# Altium schematic sheet PlataMagnitometra.SchDoc
size 594 x 420 mm; ApprovedBy: Шилкин; CheckedBy: Шилкин; Author: Шилкин; SheetNumber: 1; SheetTotal: 2
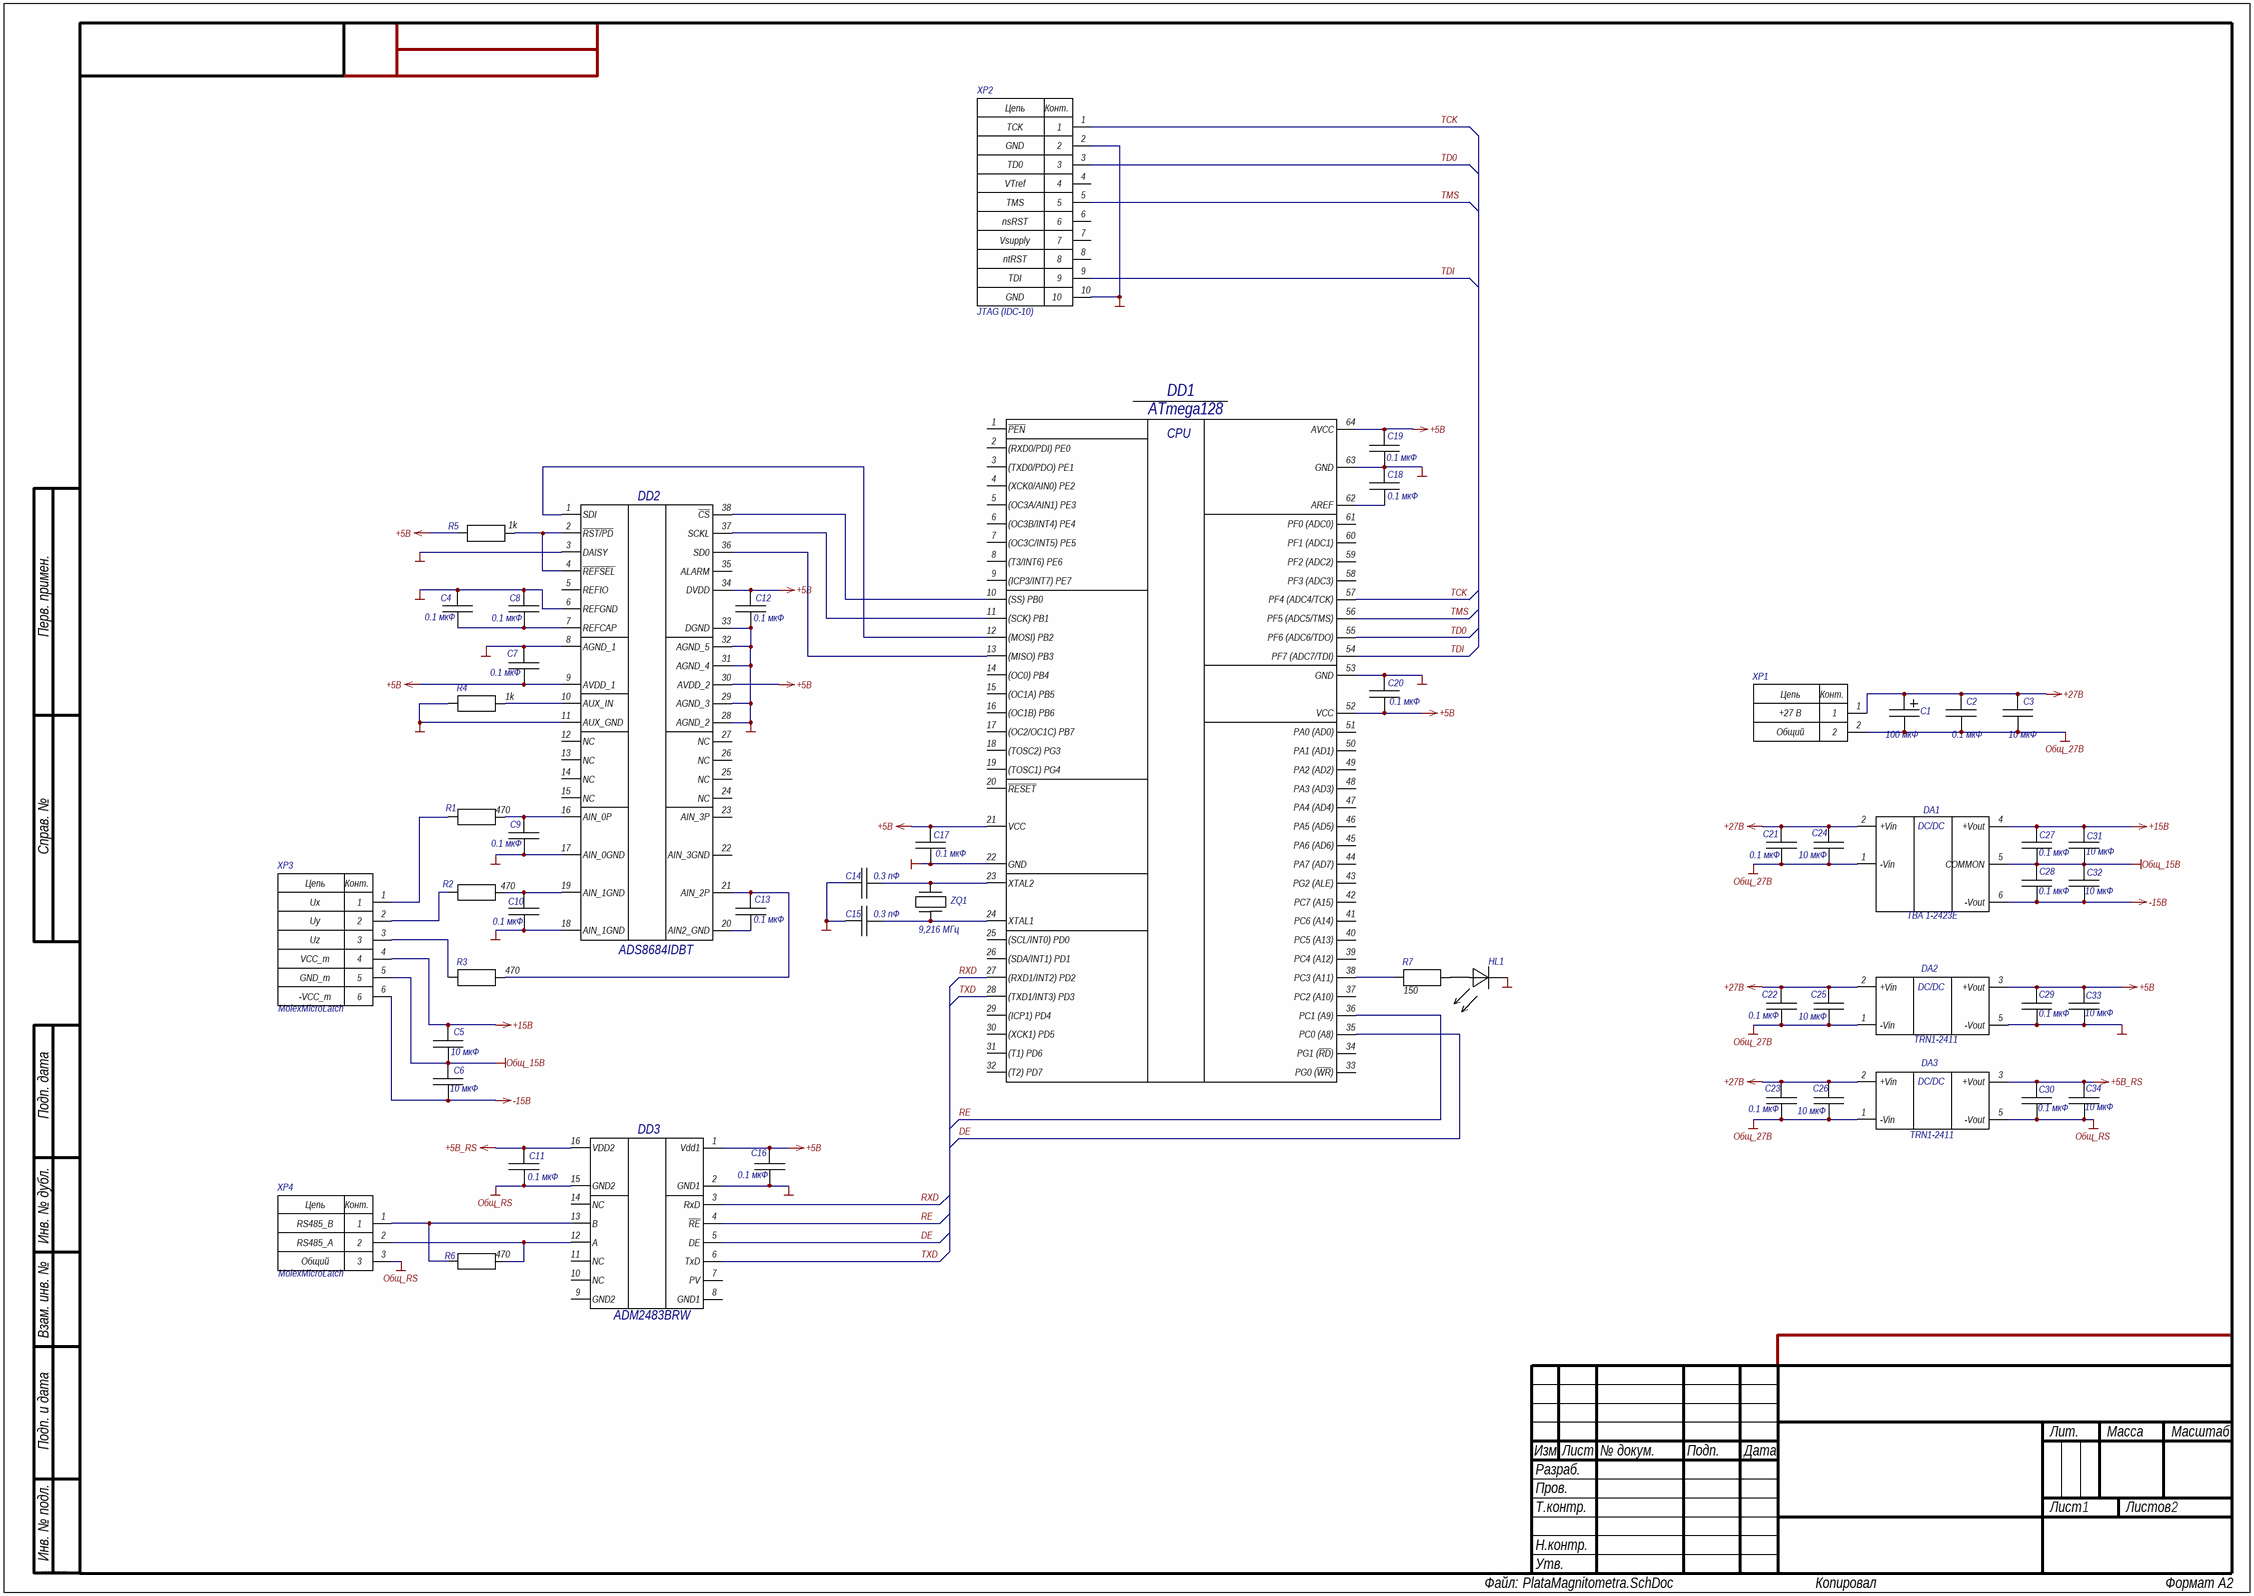
[diagram p0: PlataMagnitometra.SchDoc]

## Parts
C1  value 100 мкФ  [TANT CAP D]  (hidden comment: Конденсатор электрол. 10 В 100 мкФ Ом, ±10%, TANT CAP D)
C2  value 0.1 мкФ  [CAP0805]  (hidden comment: Конденсатор керамич. 50 В 0.1 мкФ Ом, ±10%, X7R SMD 0805)
C3  value 10 мкФ  [CAP0805]  (hidden comment: Конденсатор керамич. 50 В 10 мкФ Ом, ±10%, X5R SMD 0805)
C4  value 0.1 мкФ  [CAP0805]  (hidden comment: Конденсатор керамич. 50 В 0.1 мкФ Ом, ±10%, X7R SMD 0805)
C5  value 10 мкФ  [CAP0805]  (hidden comment: Конденсатор керамич. 50 В 10 мкФ Ом, ±10%, X5R SMD 0805)
C6  value 10 мкФ  [CAP0805]  (hidden comment: Конденсатор керамич. 50 В 10 мкФ Ом, ±10%, X5R SMD 0805)
C7  value 0.1 мкФ  [CAP0805]  (hidden comment: Конденсатор керамич. 50 В 0.1 мкФ Ом, ±10%, X7R SMD 0805)
C8  value 0.1 мкФ  [CAP0805]  (hidden comment: Конденсатор керамич. 50 В 0.1 мкФ Ом, ±10%, X7R SMD 0805)
C9  value 0.1 мкФ  [CAP0805]  (hidden comment: Конденсатор керамич. 50 В 0.1 мкФ Ом, ±10%, X7R SMD 0805)
C10  value 0.1 мкФ  [CAP0805]  (hidden comment: Конденсатор керамич. 50 В 0.1 мкФ Ом, ±10%, X7R SMD 0805)
C11  value 0.1 мкФ  [CAP0805]  (hidden comment: Конденсатор керамич. 50 В 0.1 мкФ Ом, ±10%, X7R SMD 0805)
C12  value 0.1 мкФ  [CAP0805]  (hidden comment: Конденсатор керамич. 50 В 0.1 мкФ Ом, ±10%, X7R SMD 0805)
C13  value 0.1 мкФ  [CAP0805]  (hidden comment: Конденсатор керамич. 50 В 0.1 мкФ Ом, ±10%, X7R SMD 0805)
C14  value 0.3 пФ  [CAP0805]  (hidden comment: Конденсатор керамич. 50 В 0.3 пФ Ом, +0.25pF, X5R SMD 0805)
C15  value 0.3 пФ  [CAP0805]  (hidden comment: Конденсатор керамич. 50 В 0.3 пФ Ом, +0.25pF, X5R SMD 0805)
C16  value 0.1 мкФ  [CAP0805]  (hidden comment: Конденсатор керамич. 50 В 0.1 мкФ Ом, ±10%, X7R SMD 0805)
C17  value 0.1 мкФ  [CAP0805]  (hidden comment: Конденсатор керамич. 50 В 0.1 мкФ Ом, ±10%, X7R SMD 0805)
C18  value 0.1 мкФ  [CAP0805]  (hidden comment: Конденсатор керамич. 50 В 0.1 мкФ Ом, ±10%, X7R SMD 0805)
C19  value 0.1 мкФ  [CAP0805]  (hidden comment: Конденсатор керамич. 50 В 0.1 мкФ Ом, ±10%, X7R SMD 0805)
C20  value 0.1 мкФ  [CAP0805]  (hidden comment: Конденсатор керамич. 50 В 0.1 мкФ Ом, ±10%, X7R SMD 0805)
C21  value 0.1 мкФ  [CAP0805]  (hidden comment: Конденсатор керамич. 50 В 0.1 мкФ Ом, ±10%, X7R SMD 0805)
C22  value 0.1 мкФ  [CAP0805]  (hidden comment: Конденсатор керамич. 50 В 0.1 мкФ Ом, ±10%, X7R SMD 0805)
C23  value 0.1 мкФ  [CAP0805]  (hidden comment: Конденсатор керамич. 50 В 0.1 мкФ Ом, ±10%, X7R SMD 0805)
C24  value 10 мкФ  [CAP0805]  (hidden comment: Конденсатор керамич. 50 В 10 мкФ Ом, ±10%, X5R SMD 0805)
C25  value 10 мкФ  [CAP0805]  (hidden comment: Конденсатор керамич. 50 В 10 мкФ Ом, ±10%, X5R SMD 0805)
C26  value 10 мкФ  [CAP0805]  (hidden comment: Конденсатор керамич. 50 В 10 мкФ Ом, ±10%, X5R SMD 0805)
C27  value 0.1 мкФ  [CAP0805]  (hidden comment: Конденсатор керамич. 50 В 0.1 мкФ Ом, ±10%, X7R SMD 0805)
C28  value 0.1 мкФ  [CAP0805]  (hidden comment: Конденсатор керамич. 50 В 0.1 мкФ Ом, ±10%, X7R SMD 0805)
C29  value 0.1 мкФ  [CAP0805]  (hidden comment: Конденсатор керамич. 50 В 0.1 мкФ Ом, ±10%, X7R SMD 0805)
C30  value 0.1 мкФ  [CAP0805]  (hidden comment: Конденсатор керамич. 50 В 0.1 мкФ Ом, ±10%, X7R SMD 0805)
C31  value 10 мкФ  [CAP0805]  (hidden comment: Конденсатор керамич. 50 В 10 мкФ Ом, ±10%, X5R SMD 0805)
C32  value 10 мкФ  [CAP0805]  (hidden comment: Конденсатор керамич. 50 В 10 мкФ Ом, ±10%, X5R SMD 0805)
C33  value 10 мкФ  [CAP0805]  (hidden comment: Конденсатор керамич. 50 В 10 мкФ Ом, ±10%, X5R SMD 0805)
C34  value 10 мкФ  [CAP0805]  (hidden comment: Конденсатор керамич. 50 В 10 мкФ Ом, ±10%, X5R SMD 0805)
DA1  Model: TBA 1-2423E  [TBA12411E]  (hidden comment: DC/DC, 15Вт, Uвх: 18-36В, Uвых: 15ВDC, Iвых: 500мА)
DA2  Model: TRN1-2411  [TRN1]  (hidden comment: DC/DC 1Вт, Uвх 18-36В, 5ВDC, Iвых 200мА)
DA3  Model: TRN1-2411  [TRN1]  (hidden comment: DC/DC 1Вт, Uвх 18-36В, 5ВDC, Iвых 200мА)
DD1  ATmega128  [TQFP64]
DD2  ADS8684IDBT  [38TSSOP]
DD3  ADM2483BRW  [SOIC-16 WIDE]
HL1  Светодиод SMD KP-2012  [LED0805 Red]  (value not drawn)
R1  value 470  [RES0805]  (hidden comment: Чип резистор 0.125Вт 470 Ом, 5%,  SMD SMD 0805)
R2  value 470  [RES0805]  (hidden comment: Чип резистор 0.125Вт 470 Ом, 5%,  SMD SMD 0805)
R3  value 470  [RES0805]  (hidden comment: Чип резистор 0.125Вт 470 Ом, 5%,  SMD SMD 0805)
R4  value 1k  [RES0805]  (hidden comment: Чип резистор 0.125Вт 1k Ом, 5%,  SMD SMD 0805)
R5  value 1k  [RES0805]  (hidden comment: Чип резистор 0.125Вт 1k Ом, 5%,  SMD SMD 0805)
R6  value 470  [RES0805]  (hidden comment: Чип резистор 0.125Вт 470 Ом, 5%,  SMD SMD 0805)
R7  value 150  [RES0805]  (hidden comment: Чип резистор 0.125Вт 150 Ом, 5%,  SMD SMD 0805)
XP1  Коннектор JST Corporation, 2 мм, 1 ряд, 2 контактa  [2pinMicroLatch]  (value not drawn)
XP2  JTAG (IDC-10)  [IDC10]
XP3  value MolexMicroLatch  [6pinMicroLatch]  (hidden comment: Коннектор Micro-Latch, Signal, 2 мм, 1 ряд, 6 контактов)
XP4  value MolexMicroLatch  [3pinMicroLatch]  (hidden comment: Коннектор Micro-Latch, Signal, 2 мм, 1 ряд, 3 контактa)
ZQ1  value 9,216 МГц  [HC49S4HSMD]  (hidden comment: Резонатор кварцевый низкопрофильный 9.216 МГц SMT)

## Nets
+5В: C7.1 C12.2 C16.1 C17.2 C19.1 C20.2 C29.1 C33.1 DA2.3(+Vout) DD1.21(VCC) DD1.52(VCC) DD1.64(AVCC) DD2.9(AVDD_1) DD2.30(AVDD_2) DD2.34(DVDD) DD3.1(Vdd1) R5.2
+5В_RS: C11.2 C30.1 C34.1 DA3.3(+Vout) DD3.16(VDD2)
+15В: C5.1 C27.1 C31.1 DA1.4(+Vout) XP3.4
+27В: C1.2 C2.1 C3.1 C21.1 C22.1 C23.1 C24.1 C25.1 C26.1 DA1.2(+Vin) DA2.2(+Vin) DA3.2(+Vin) XP1.1
-15В: C6.2 C28.2 C32.2 DA1.6(-Vout) XP3.6
Общ_5В: C4.2 C7.2 C8.2 C9.1 C10.1 C12.1 C14.2 C15.2 C16.2 C17.1 C18.1 C19.2 C20.1 C29.2 C33.2 DA2.5(-Vout) DD1.22(GND) DD1.53(GND) DD1.63(GND) DD2.3(DAISY) DD2.6(REFGND) DD2.8(AGND_1) DD2.11(AUX_GND) DD2.17(AIN_0GND) DD2.18(AIN_1GND) DD2.28(AGND_2) DD2.29(AGND_3) DD2.31(AGND_4) DD2.32(AGND_5) DD2.33(DGND) DD3.2(GND1) HL1.1(C) R4.2 XP2.2 XP2.10
Общ_15В: C5.2 C6.1 C27.2 C28.1 C31.2 C32.1 DA1.5(COMMON) XP3.5
Общ_27В: C1.1 C2.2 C3.2 C21.2 C22.2 C23.2 C24.2 C25.2 C26.2 DA1.1(-Vin) DA2.1(-Vin) DA3.1(-Vin) XP1.2
Общ_RS: C11.1 C30.2 C34.2 DA3.5(-Vout) DD3.15(GND2) XP4.3
DE: DD1.35(PC0_(A8)) DD3.5(DE)
RE: DD1.36(PC1_(A9)) DD3.4(~{RE})
RXD: DD1.27((RXD1/INT2)_PD2) DD3.3(RxD)
TCK: DD1.57(PF4_(ADC4/TCK)) XP2.1
TD0: DD1.55(PF6_(ADC6/TDO)) XP2.3
TDI: DD1.54(PF7_(ADC7/TDI)) XP2.9
TMS: DD1.56(PF5_(ADC5/TMS)) XP2.5
TXD: DD1.28((TXD1/INT3)_PD3) DD3.6(TxD)
NetC4_1: C4.1 C8.1 DD2.7(REFCAP)
NetC9_2: C9.2 DD2.16(AIN_0P) R1.1
NetC10_2: C10.2 DD2.19(AIN_1GND) R2.1
NetC13_1: C13.1 DD2.20(AIN2_GND)
NetC13_2: C13.2 DD2.21(AIN_2P) R3.1
NetC14_1: C14.1 DD1.23(XTAL2) ZQ1.2
NetC15_1: C15.1 DD1.24(XTAL1) ZQ1.1
NetC18_2: C18.2 DD1.62(AREF)
NetDD1_10: DD1.10((SS)_PB0) DD2.38(~{CS})
NetDD1_11: DD1.11((SCK)_PB1) DD2.37(SCKL)
NetDD1_12: DD1.12((MOSI)_PB2) DD2.1(SDI)
NetDD1_13: DD1.13((MISO)_PB3) DD2.36(SD0)
NetDD1_38: DD1.38(PC3_(A11)) R7.2
NetDD2_2: DD2.2(~{RST/PD}) DD2.4(~{REFSEL}) R5.1
NetDD2_10: DD2.10(AUX_IN) R4.1
NetDD3_12: DD3.12(A) R6.1 XP4.2
NetDD3_13: DD3.13(B) R6.2 XP4.1
NetHL1_2: HL1.2(A) R7.1
NetR1_2: R1.2 XP3.1
NetR2_2: R2.2 XP3.2
NetR3_2: R3.2 XP3.3

Not connected (* = marked no-connect by the designer): DD1 1(~{PEN}) 2((RXD0/PDI)_PE0) 3((TXD0/PDO)_PE1) 4((XCK0/AIN0)_PE2) 5((OC3A/AIN1)_PE3) 6((OC3B/INT4)_PE4) 7((OC3C/INT5)_PE5) 8((T3/INT6)_PE6) 9((ICP3/INT7)_PE7) 14((OC0)_PB4) 15((OC1A)_PB5) 16((OC1B)_PB6) 17((OC2/OC1C)_PB7) 18((TOSC2)_PG3) 19((TOSC1)_PG4) 20(~{RESET}) 25((SCL/INT0)_PD0) 26((SDA/INT1)_PD1) 29((ICP1)_PD4) 30((XCK1)_PD5) 31((T1)_PD6) 32((T2)_PD7) 33(PG0_(~{WR})) 34(PG1_(~{RD})) 37(PC2_(A10)) 39(PC4_(A12)) 40(PC5_(A13)) 41(PC6_(A14)) 42(PC7_(A15)) 43(PG2_(ALE)) 44(PA7_(AD7)) 45(PA6_(AD6)) 46(PA5_(AD5)) 47(PA4_(AD4)) 48(PA3_(AD3)) 49(PA2_(AD2)) 50(PA1_(AD1)) 51(PA0_(AD0)) 58(PF3_(ADC3)) 59(PF2_(ADC2)) 60(PF1_(ADC1)) 61(PF0_(ADC0)); DD2 5(REFIO) 12(NC) 13(NC) 14(NC) 15(NC) 22(AIN_3GND) 23(AIN_3P) 24(NC) 25(NC) 26(NC) 27(NC) 35(ALARM); DD3 7(PV) 8(GND1) 9(GND2) 10(NC) 11(NC) 14(NC); XP2 4 6 7 8

## Notes on the sheet
- Перв. примен.
- Справ. №
- Подп. дата
- Инв. № дубл.
- Взам. инв. №
- Подп. и дата
- Изм.
- Разраб.
- Лист
- № докум.
- Подп.
- Дата
- Лит.
- Масса
- Масштаб
- Пров.
- Т.контр.
- Листов
- Инв. № подл.
- Н.контр.
- Утв.
- ALTIUM GOSTBOM2.0 KEV
- Файл:
- Копировал
- Формат А2
- (in symbol 2PinConn) Цепь; Конт.
- (in symbol 3PinConn) Цепь; Конт.
- (in symbol 6PinConn) Цепь; Конт.
- (in symbol 10PinConn) Цепь; Конт.
- (in symbol ATmega128) CPU
- (in symbol TBA 1 - double) DC/DC
- (in symbol TRN 1 - single) DC/DC

## Library data of the parts
C1 = POL CAP: Конденсатор электролитический танталовый; Manufacturer: Китай; PowerVoltage: 10 В; ProductCode: TECAP100/10VD10; CompType: Конденсатор электрол.; Foot: TANT CAP D; Accuracy: ±10%
C2 C4 C7-C13 C16-C23 C27-C30 = Capacitor: Конденсатор керамич. SMD; Manufacturer: Murata Electronics; PowerVoltage: 50 В; ProductCode: GRM21BR71H104K; Foot: 0805; CompType: Конденсатор керамич.; Accuracy: ±10%; Temperature: X7R
C3 C5 C6 C24-C26 C31-C34 = Capacitor: Конденсатор керамич. SMD; Manufacturer: Murata Electronics; PowerVoltage: 50 В; ProductCode: GRM21BR61A106KE19B; Foot: 0805; CompType: Конденсатор керамич.; Accuracy: ±10%; Temperature: X5R
C14 C15 = Capacitor: Конденсатор керамич. SMD; Manufacturer: Yageo; PowerVoltage: 50 В; ProductCode: CC0805CRNPO9BN3R0; Foot: 0805; CompType: Конденсатор керамич.; Accuracy: +0.25pF; Temperature: X5R
DA1 = TBA 1 - double: DC/DC, 15Вт, Uвх: 18-36В, Uвых: 15ВDC, Iвых: 33мА; Manufacturer: TracoPower; ProductCode: TBA1-2423E; Value: *
DA2 DA3 = TRN 1 - single: Manufacturer: TracoPower; ProductCode: TRN1-2411; Value: *
DD1 = ATmega128: Manufacturer: Microchip Technology; ProductCode: ATMEGA128-16AU; Model: ATMEGA128-16AU
DD2 = ADS8684IDBT: Manufacturer: Texas Instruments; ProductCode: ADS8684IDBT; Model: ADS8684IDBT
DD3 = ADM2483: Manufacturer: AnalogDevices; ProductCode: ADM2483BRWZ; Model: ADM2483BRW
HL1 = LED: Светодиод; Help: SYC - жёлт., MGC - зел., ID - красн.; CompType: Светодиод SMD KP-2012
R1-R3 R6 = Resistor: SMD resistor; Manufacturer: Тайвань; FullName: Чип резисторSMD 08054705%; ProductCode: RC0805JR-07470RL; CompType: Чип резистор; PowerVoltage: 0.125Вт; Accuracy: 5%; Foot: SMD 0805
R4 R5 = Resistor: SMD resistor; Manufacturer: Panasonic; FullName: Чип резисторSMD 08051k5%; ProductCode: ERJP06J102V; CompType: Чип резистор; PowerVoltage: 0.125Вт; Accuracy: 5%; Foot: SMD 0805
R7 = Resistor: SMD resistor; Manufacturer: Тайвань; FullName: Чип резисторSMD 08051505%; ProductCode: RC0805JR-07150RL; CompType: Чип резистор; PowerVoltage: 0.125Вт; Accuracy: 5%; Foot: SMD 0805
XP1 = 2PinConn: B2B-EH-A (LF); Value: 2 Pin Connector; 1: +27 В; 2: Общий; Manufacturer: *; ProductCode: *
XP2 = 10PinConn: 10PinConnector; 1: TCK; 2: GND; 3: TD0; 4: VTref; 5: TMS; 6: nsRST; 7: Vsupply; 8: ntRST; 9: TDI; 10: GND; Manufacturer: *; ProductCode: *
XP3 = 6PinConn: 1: Ux; 2: Uy; 3: Uz; 4: VCC_m; 5: GND_m; 6: -VCC_m; CompType: *; Manyfacturer: *; ProductCode: *
XP4 = 3PinConn: 1: RS485_B; 2: RS485_A; 3: Общий; Manufacturer: *; ProductCode: *
ZQ1 = Quartz_resonator: Кварцевый резонатор; Manufacturer: ATMEGA128-16AU; ProductCode: ABLS-9.216MHZ-B4-T; 1: *; 2: *